# Altium project rmiic.prjpcb
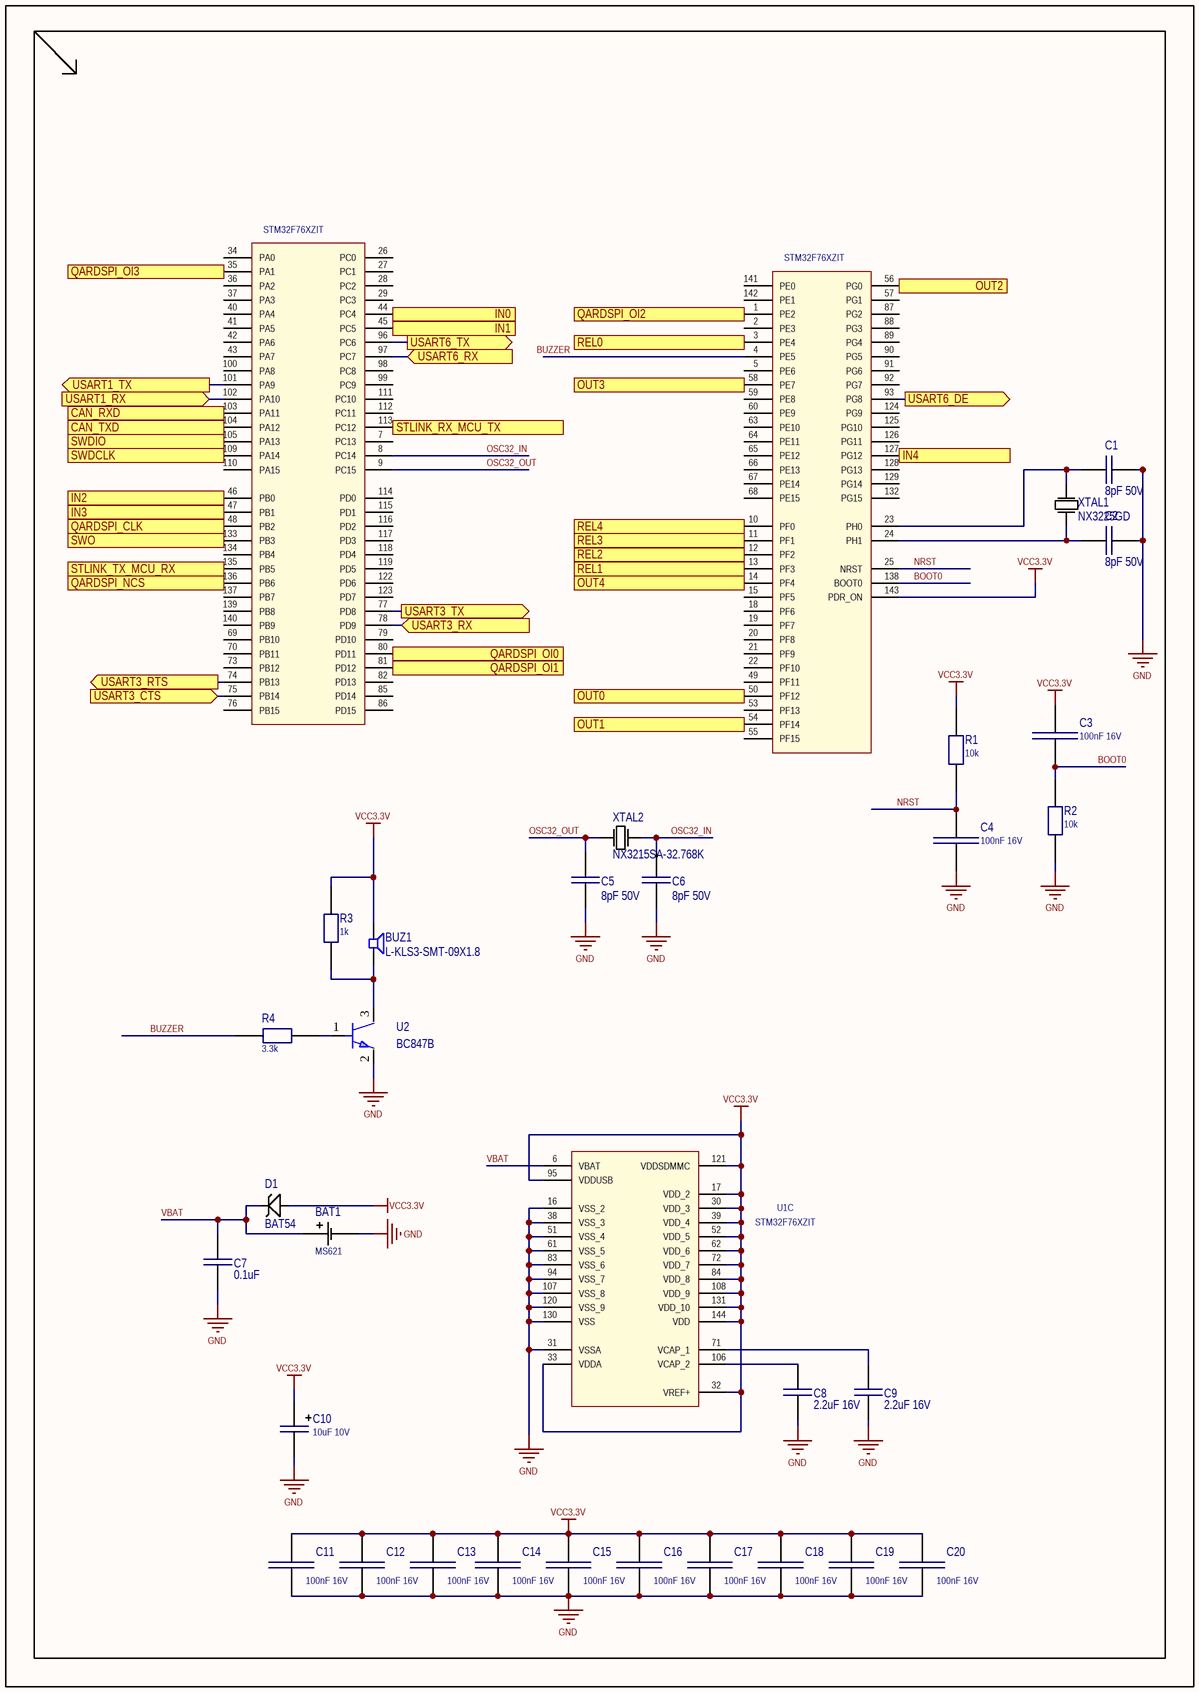
[diagram p0: MCU.SchDoc]
7 sheets, 158 parts. Net scope: flat (ports and power ports of the same name join across sheets).
Board file: PCB.pcbdoc
Sheets:
  MCU.SchDoc
  interfaces.schdoc
  dcdc.schdoc
  qspi_flash.schdoc
  connections.schdoc
  rlink.schdoc
  usb.SchDoc

## Sheet MCU.SchDoc
size 209 x 297 mm; Scale: 1:1; DocumentType: Ñõåìà ýëåêòðè÷åñêàÿ ïðèíöèïèàëüíàÿ; FirstReferrence: ÀÁÂÃ.123456.001; Title1str: {Наименование}; PageSetup: Record=PageOptions¦CenterHorizontal=False¦CenterVertical=False¦PrintScale=0.95¦XCorrection=0.00¦YCorrection=0.00¦PrintKind=1¦BorderSize=5000000¦LeftOffset=0¦BottomOffset=0¦Orientation=1¦PaperLength=1000¦PaperWidth=1000¦Scale=100¦PaperSource=15¦PrintQuality=600¦MediaType=1¦DitherType=10¦PaperKind=A4¦PrintScaleMode=1; DocumentType1str: {Документ}; DocumentType2str: {Документ}

### Parts
BAT1  MS621  [MS621]
BUZ1  L-KLS3-SMT-09X1.8  [SPKR_PKMCS0909E4000-R1]
C1  8pF 50V  [C_0603]
C2  8pF 50V  [C_0603]
C3  100nF 16V  [C_0603]
C4  100nF 16V  [C_0603]
C5  8pF 50V  [C_0603]
C6  8pF 50V  [C_0603]
C7  0.1uF  [C_0603]
C8  2.2uF 16V  [C_0603]
C9  2.2uF 16V  [C_0603]
C10  10uF 10V  [TANTAL_TYPE_A]
C11  100nF 16V  [C_0603]
C12  100nF 16V  [C_0603]
C13  100nF 16V  [C_0603]
C14  100nF 16V  [C_0603]
C15  100nF 16V  [C_0603]
C16  100nF 16V  [C_0603]
C17  100nF 16V  [C_0603]
C18  100nF 16V  [C_0603]
C19  100nF 16V  [C_0603]
C20  100nF 16V  [C_0603]
D1  BAT54  [SOT23]
R1  10k  [R_0603]
R2  10k  [R_0603]
R3  1k  [R_0603]
R4  3.3k  [R_0603]
U1  STM32F76XZIT  [TQFP144_M]  (parts A,B,C of 3)
U2  BC847B  [SOT23]
XTAL1  NX3225GD  [NX3225GD]
XTAL2  NX3215SA-32.768K  [XTAL_NX3215SA-32.768K-STD-MUA-8]

### Ports
CAN_RXD (in), CAN_TXD (out), IN0 (in), IN1 (in), IN2 (in), IN3 (in), IN4 (in), OUT0 (out), OUT1 (out), OUT2 (out), OUT3 (out), OUT4 (out), QARDSPI_CLK, QARDSPI_NCS, QARDSPI_OI0, QARDSPI_OI1, QARDSPI_OI2, QARDSPI_OI3, REL0 (out), REL1 (out), REL2 (out), REL3 (out), REL4 (out), STLINK_RX_MCU_TX, STLINK_TX_MCU_RX, SWDCLK, SWDIO, SWO, USART1_RX (in), USART1_TX (out), USART3_CTS (in), USART3_RTS (out), USART3_RX (in), USART3_TX (out), USART6_DE (out), USART6_RX (in), USART6_TX (out)

### Nets
GND: BAT1.0(-) C1.1 C2.1 C4.1 C5.1 C6.1 C7.1 C8.1 C9.1 C10.2 C11.1 C12.1 C13.1 C14.1 C15.1 C16.1 C17.1 C18.1 C19.1 C20.1 R2.1 U1.16(VSS_2) U1.31(VSSA) U1.38(VSS_3) U1.51(VSS_4) U1.61(VSS_5) U1.83(VSS_6) U1.94(VSS_7) U1.107(VSS_8) U1.120(VSS_9) U1.130(VSS) U2.2
VCC3.3V: BUZ1.1 C3.1 C10.1 C11.2 C12.2 C13.2 C14.2 C15.2 C16.2 C17.2 C18.2 C19.2 C20.2 D1.1 R1.2 R3.2 U1.17(VDD_2) U1.30(VDD_3) U1.32(VREF+) U1.33(VDDA) U1.39(VDD_4) U1.52(VDD_5) U1.62(VDD_6) U1.72(VDD_7) U1.84(VDD_8) U1.95(VDDUSB) U1.108(VDD_9) U1.121(VDDSDMMC) U1.131(VDD_10) U1.143(PDR_ON) U1.144(VDD)
BOOT0: C3.2 R2.2 U1.138(BOOT0)
BUZZER: R4.1 U1.4(PE5)
NRST: C4.2 R1.1 U1.25(NRST)
OSC32_IN: C6.2 U1.8(PC14) XTAL2.2(OSC2)
OSC32_OUT: C5.2 U1.9(PC15) XTAL2.1(OSC1)
STLINK_RX_MCU_TX: U1.113(PC12) ; port STLINK_RX_MCU_TX
STLINK_TX_MCU_RX: U1.135(PB5) ; port STLINK_TX_MCU_RX
SWCLK1: U1.109(PA14) ; port SWDCLK
SWDIO1: U1.105(PA13) ; port SWDIO
SWO1: U1.133(PB3) ; port SWO
VBAT: BAT1.1(+) C7.2 D1.3 U1.6(VBAT)
NetBUZ1_2: BUZ1.2 R3.1 U2.3
NetC1_2: C1.2 U1.23(PH0) XTAL1.2(OSC2)
NetC2_2: C2.2 U1.24(PH1) XTAL1.1(OSC1)
NetC8_2: C8.2 U1.106(VCAP_2)
NetC9_2: C9.2 U1.71(VCAP_1)
NetR4_2: R4.2 U2.1
NetR9_1: U1.44(PC4) ; port IN0
NetR13_1: U1.45(PC5) ; port IN1
NetR16_1: U1.46(PB0) ; port IN2
NetR19_1: U1.47(PB1) ; port IN3
NetR22_1: U1.127(PG12) ; port IN4
NetR24_1: U1.3(PE4) ; port REL0
NetR26_2: U1.50(PF12) ; port OUT0
NetR28_2: U1.54(PF14) ; port OUT1
NetR29_2: U1.56(PG0) ; port OUT2
NetR30_1: U1.13(PF3) ; port REL1
NetR32_2: U1.58(PE7) ; port OUT3
NetR34_2: U1.14(PF4) ; port OUT4
NetR35_1: U1.12(PF2) ; port REL2
NetR38_1: U1.11(PF1) ; port REL3
NetR41_1: U1.10(PF0) ; port REL4
NetR47_2: U1.136(PB6) ; port QARDSPI_NCS
NetU1_1: U1.1(PE2) ; port QARDSPI_OI2
NetU1_35: U1.35(PA1) ; port QARDSPI_OI3
NetU1_48: U1.48(PB2) ; port QARDSPI_CLK
NetU1_74: U1.74(PB13) ; port USART3_RTS
NetU1_75: U1.75(PB14) ; port USART3_CTS
NetU1_77: U1.77(PD8) ; port USART3_TX
NetU1_78: U1.78(PD9) ; port USART3_RX
NetU1_80: U1.80(PD11) ; port QARDSPI_OI0
NetU1_81: U1.81(PD12) ; port QARDSPI_OI1
NetU1_93: U1.93(PG8) ; port USART6_DE
NetU1_96: U1.96(PC6) ; port USART6_TX
NetU1_97: U1.97(PC7) ; port USART6_RX
NetU1_101: U1.101(PA9) ; port USART1_TX
NetU1_102: U1.102(PA10) ; port USART1_RX
NetU1_103: U1.103(PA11) ; port CAN_RXD
NetU1_104: U1.104(PA12) ; port CAN_TXD

Not connected (* = marked no-connect by the designer): U1 2(PE3) 5(PE6) 7(PC13) 15(PF5) 18(PF6) 19(PF7) 20(PF8) 21(PF9) 22(PF10) 26(PC0) 27(PC1) 28(PC2) 29(PC3) 34(PA0) 36(PA2) 37(PA3) 40(PA4) 41(PA5) 42(PA6) 43(PA7) 49(PF11) 53(PF13) 55(PF15) 57(PG1) 59(PE8) 60(PE9) 63(PE10) 64(PE11) 65(PE12) 66(PE13) 67(PE14) 68(PE15) 69(PB10) 70(PB11) 73(PB12) 76(PB15) 79(PD10) 82(PD13) 85(PD14) 86(PD15) 87(PG2) 88(PG3) 89(PG4) 90(PG5) 91(PG6) 92(PG7) 98(PC8) 99(PC9) 100(PA8) 110(PA15) 111(PC10) 112(PC11) 114(PD0) 115(PD1) 116(PD2) 117(PD3) 118(PD4) 119(PD5) 122(PD6) 123(PD7) 124(PG9) 125(PG10) 126(PG11) 128(PG13) 129(PG14) 132(PG15) 134(PB4) 137(PB7) 139(PB8) 140(PB9) 141(PE0) 142(PE1)

### Library data of the parts
BAT1 = MS621: Battery; Part Number: MS621; Alternative Part: *
BUZ1 = BUZZER: Piezoelectric Sounders; Alternative Part: PKLCS1212E40A1-R1; Part Number: L-KLS3-SMT-09X1.8
C1 C2 C5 C6 = CAP_SMD: Capacitor; Part Number: CC0603DRNPO9BN8R0; Alternative Part: *; Value: 8pF 50V
C3 C4 C11-C20 = C0603: Capacitor; Part Number: CC0603KPX7R9BB104; Value: 100nF 16V
C7 = CAP_SMD: Capacitor; Part Number: CC0603KPX7R9BB104; Alternative Part: *; Value: 0.1uF
C8 C9 = CAP_SMD: Capacitor; Part Number: CC0603KRX5R7BB225; Alternative Part: *; Value: 2.2uF 16V
C10 = TANTAL_CAP: Tantal Capacitor; Part Number: 293D106X9010A2TE3; Alternative Part: *; Value: 10uF 10V
D1 = BAT54: Diode; Part Number: BAT54
R1 R2 = RES_SMD: Resistor; Part Number: RC0603FR-0710KL; Alternative Part: *; Value: 10k
R3 = RES_SMD: Resistor; Part Number: RC0603FR-071KL; Alternative Part: *; Value: 1k
R4 = RES_SMD: Resistor; Part Number: RC0603FR-073K3L; Alternative Part: *; Value: 3.3k
U1 = STM32F76XZXT: Part Number: STM32F765ZGT; C: Copyright (C) 2016 Accelerated Designs. All rights reserved; Vendor: STMicroelectronics; Value: STM32F76XZXT; Manufacturer_Part_Number: STM32F76XZXT; Copyright: Copyright (C) 2016 Accelerated Designs. All rights reserved
XTAL1 = NX3225GD: Crystal Oscillator; Part Number: NX3225GD-8MHZ-EXS00A-CG05041; Alternative Part: *
XTAL2 = NX3215SA-32.768K: Crystal Oscillator; Part Number: NX3215SA-32.768K-10PPM-45KOHM-6PF; Alternative Part: *
U2 = BC847B: Part Number: BC847B

## Sheet interfaces.schdoc
size 209 x 297 mm; Scale: 1:1; DocumentType: Ñõåìà ýëåêòðè÷åñêàÿ ïðèíöèïèàëüíàÿ; FirstReferrence: ÀÁÂÃ.123456.001; PageSetup: Record=PageOptions¦CenterHorizontal=False¦CenterVertical=False¦PrintScale=0.95¦XCorrection=0.00¦YCorrection=0.00¦PrintKind=1¦BorderSize=5000000¦LeftOffset=0¦BottomOffset=0¦Orientation=1¦PaperLength=1000¦PaperWidth=1000¦Scale=100¦PaperSource=15¦PrintQuality=600¦MediaType=1¦DitherType=10¦PaperKind=A4¦PrintScaleMode=1
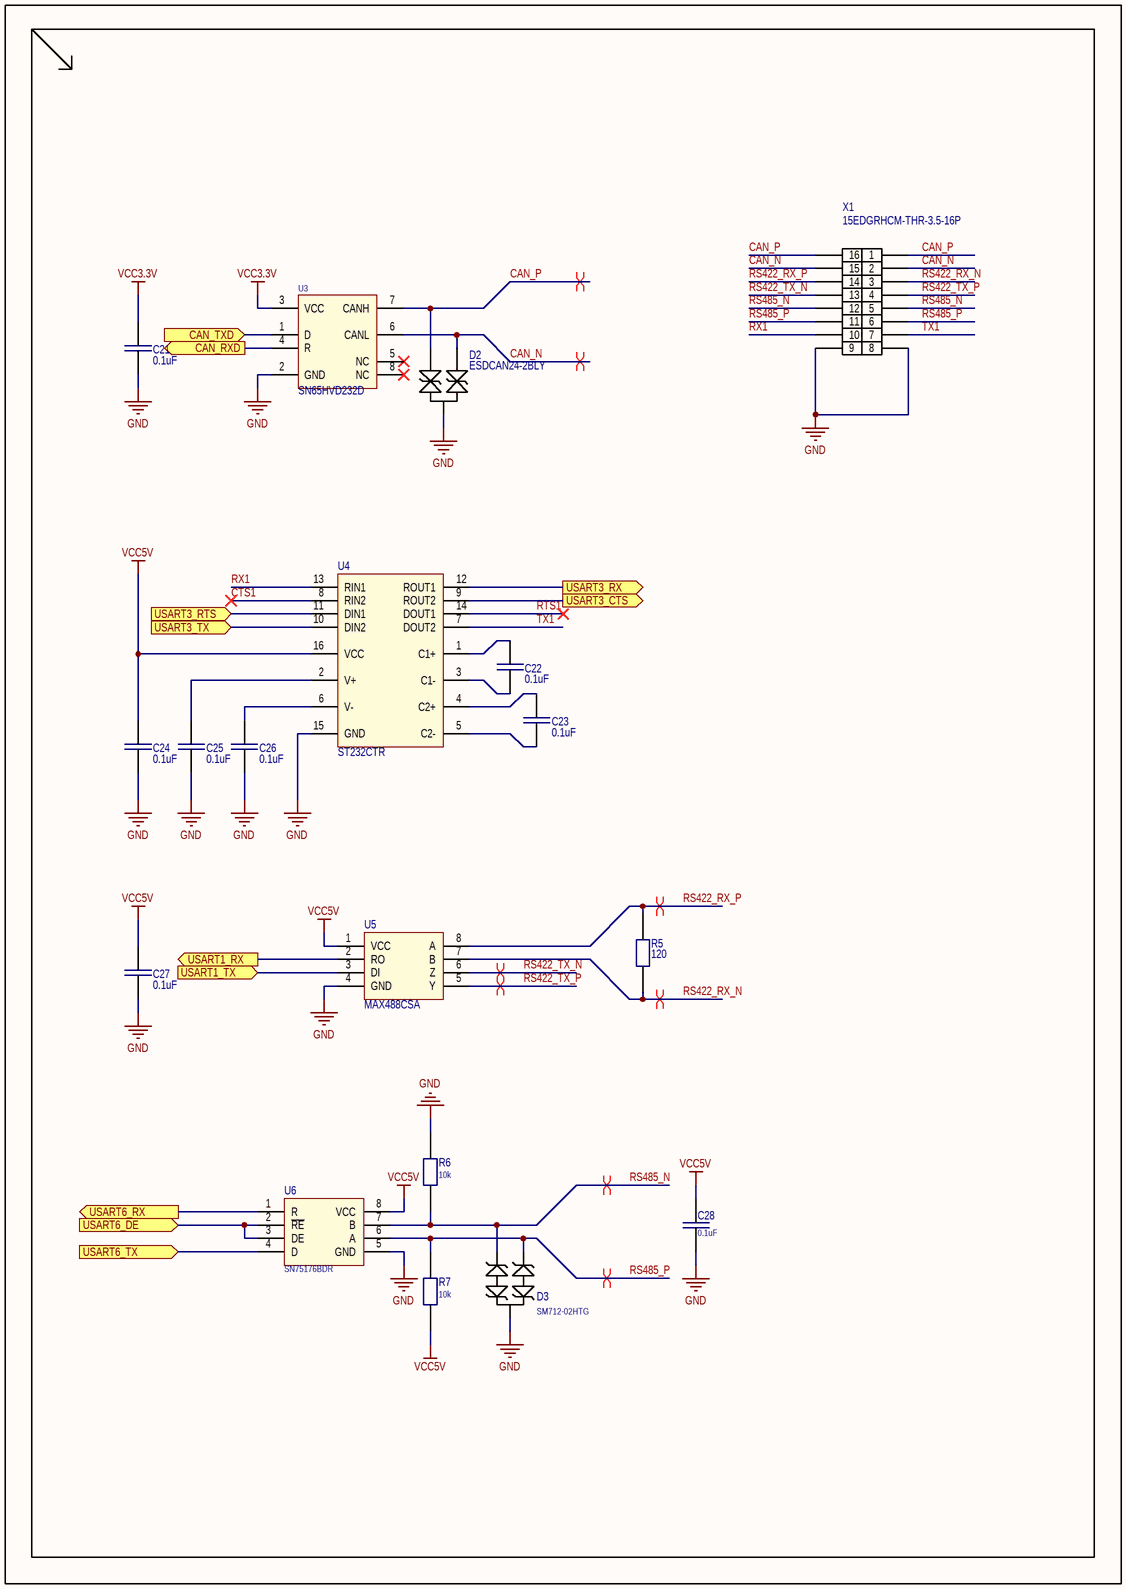
[diagram p1: interfaces.schdoc]

### Parts
C21  0.1uF  [C_0603]
C22  0.1uF  [C_0603]
C23  0.1uF  [C_0603]
C24  0.1uF  [C_0603]
C25  0.1uF  [C_0603]
C26  0.1uF  [C_0603]
C27  0.1uF  [C_0603]
C28  0.1uF  [C_0603]
D2  ESDCAN24-2BLY  [SOT23]
D3  SM712-02HTG  [SOT23]
R5  120  [R_0603]
R6  10k  [R_0603]
R7  10k  [R_0603]
U3  SN65HVD232D  [SO-8_M]
U4  ST232CTR  [TSSOP16_STM]
U5  MAX488CSA  [SO-8_M]
U6  SN75176BDR  [SO-8]
X1  15EDGRHCM-THR-3.5-16P  [DMC 1,5/ 8-G1F-3,5-LR P20THR / 1787072]

### Ports
CAN_RXD (out), CAN_TXD (in), USART1_RX (out), USART1_TX (in), USART3_CTS (out), USART3_RTS (in), USART3_RX (out), USART3_TX (in), USART6_DE (in), USART6_RX (out), USART6_TX (in)

### Nets
GND: C21.1 C24.1 C25.1 C26.1 C27.1 C28.1 D2.3 D3.3 R6.2 U3.2(GND) U4.15(GND) U5.4(GND) U6.5(GND) X1.8 X1.9
VCC3.3V: C21.2 U3.3(VCC)
VCC5V: C24.2 C27.2 C28.2 R7.1 U4.16(VCC) U5.1(VCC) U6.8(VCC)
CAN_N: D2.2 U3.6(CANL) X1.2 X1.15
CAN_P: D2.1 U3.7(CANH) X1.1 X1.16
CTS1: U4.8(RIN2)
RS422_RX_N: R5.2 U5.7(B) X1.3
RS422_RX_P: R5.1 U5.8(A) X1.14
RS422_TX_N: U5.6(Z) X1.13
RS422_TX_P: U5.5(Y) X1.4
RS485_N: D3.1 R6.1 U6.7(B) X1.5 X1.12
RS485_P: D3.2 R7.2 U6.6(A) X1.6 X1.11
RTS1: U4.14(DOUT1)
RX1: U4.13(RIN1) X1.10
TX1: U4.7(DOUT2) X1.7
NetC22_1: C22.1 U4.1(C1+)
NetC22_2: C22.2 U4.3(C1-)
NetC23_1: C23.1 U4.4(C2+)
NetC23_2: C23.2 U4.5(C2-)
NetC25_2: C25.2 U4.2(V+)
NetC26_2: C26.2 U4.6(V-)
NetU1_74: U4.11(DIN1) ; port USART3_RTS
NetU1_75: U4.9(ROUT2) ; port USART3_CTS
NetU1_77: U4.10(DIN2) ; port USART3_TX
NetU1_78: U4.12(ROUT1) ; port USART3_RX
NetU1_93: U6.2(~{RE}) U6.3(DE) ; port USART6_DE
NetU1_96: U6.4(D) ; port USART6_TX
NetU1_97: U6.1(R) ; port USART6_RX
NetU1_101: U5.3(DI) ; port USART1_TX
NetU1_102: U5.2(RO) ; port USART1_RX
NetU1_103: U3.4(R) ; port CAN_RXD
NetU1_104: U3.1(D) ; port CAN_TXD

Not connected (* = marked no-connect by the designer): U3 5(NC)* 8(NC)*

### Layout directives
differential pair: CAN_N, CAN_P, RS422_RX_N, RS422_RX_P, RS422_TX_N, RS422_TX_P, RS485_N, RS485_P

### Library data of the parts
C21 C27 C28 = CAP_SMD: as C7 on sheet MCU; Alternative Part: *; Value: 0.1uF
C22-C26 = C0603: Capacitor; Part: CC0603KPX7R9BB104; Value: 0.1uF
D2 = ESD_CAN: ESD; Value: ESDCAN24-2BLY; Part Number: ESDCAN24-2BLY; Alternative Part: *
D3 = ESD: Value: SM712-02HTG; Part Number: SM712-02HTG; Alternative Part: *
R5 = RES_SMD: Resistor; Part Number: RC0603FR-07120RL; Alternative Part: *; Value: 120
R6 R7 = RES_SMD: Resistor; Part Number: RC0603FR-0710KL; Alternative Part: *; Value: 10k
U3 = SN65HVD232D: CAN_transiever; Part Number: SN65HVD232D; Alternative Part: *
U4 = ST232CTR: No Description Available; Mfr_Name: STMicroelectronics; Copyright: Copyright (C) 2022 Ultra Librarian. All rights reserved.; Part Number: ST232CTR; RefDes: RefDes; Type: DEV
U5 = ADM4855ARZ: RS485 Full Duplex Convertor; Part Number: MAX488CSA; Alternative Part: ADM4855ARZ
U6 = SN75176BDR: RS485 Half Duplex Convertor; Part Number: SN75176BDR
X1 = DMC 1,5/ 8-G1F-3,5-LR P20THR / 1787072: Part Number: 15EDGRHCM-THR-3.5-16P

## Sheet dcdc.schdoc
size 209 x 297 mm; PageSetup: Record=PageOptions|CenterHorizontal=False|CenterVertical=False|PrintScale=0.95|XCorrection=0.00|YCorrection=0.00|PrintKind=1|BorderSize=5000000|LeftOffset=0|BottomOffset=0|Orientation=1|PaperLength=1000|PaperWidth=1000|Scale=100|PaperSource=15|PrintQuality=600|MediaType=1|DitherType=10|PaperKind=A4|PrintScaleMode=1
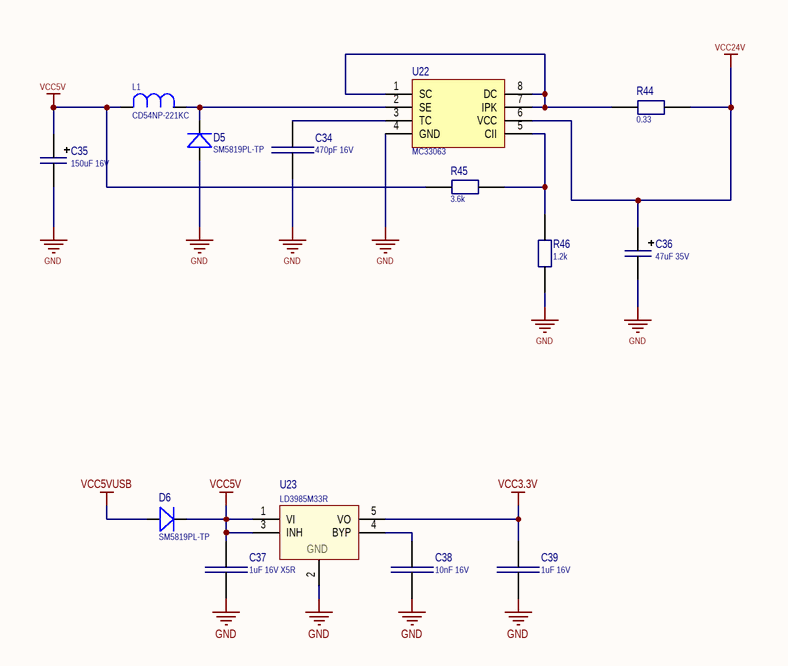
[diagram p2: dcdc.schdoc]

### Parts
C34  470pF 16V  [C_0603]
C35  150uF 16V  [TANTAL_TYPE_D]
C36  47uF 35V  [TANTAL_TYPE_X]
C37  1uF 16V X5R  [C_0603]
C38  10nF 16V  [C_0603]
C39  1uF 16V  [C_0603]
D5  SM5819PL-TP  [SOD-123]
D6  SM5819PL-TP  [SOD-123]
L1  CD54NP-221KC  [CD54NP]
R44  0.33  [R_1206]
R45  3.6k  [R_0603]
R46  1.2k  [R_0603]
U22  MC33063  [SO-8]
U23  LD3985M33R  [SOT23-5]

### Nets
GND: C34.1 C35.2 C36.2 C37.1 C38.1 C39.1 D5.1(A) R46.1 U22.4(GND) U23.2(GND)
VCC3.3V: C39.2 U23.5(VO)
VCC5V: C35.1 C37.2 D6.2(K) L1.2 R45.1 U23.1(VI) U23.3(INH)
VCC5VUSB: D6.1(A)
VCC24V: C36.1 R44.1 U22.6(VCC)
NetC34_2: C34.2 U22.3(TC)
NetC38_2: C38.2 U23.4(BYP)
NetD5_2: D5.2(K) L1.1 U22.2(SE)
NetR44_2: R44.2 U22.1(SC) U22.7(IPK) U22.8(DC)
NetR45_2: R45.2 R46.2 U22.5(CII)

### Library data of the parts
C34 = C0603: Capacitor; Part Number: CC0603KRX7R9BB471; Value: 470pF 16V
C35 = TANTAL_CAP: Tantal Capacitor; Part Number: T491D157K016AT; Alternative Part: *; Value: 150uF 16V
C36 = TANTAL_CAP: Tantal Capacitor; Part Number: T491X476K035AT; Alternative Part: *; Value: 47uF 35V
C37 C39 = C0603: Capacitor; Part Number: CC0603KRX7R7BB105
  C37: Value: 1uF 16V X5R
  C39: Value: 1uF 16V
C38 = C0603: Capacitor; Part Number: CC0603JRX7R7BB103; Value: 10nF 16V
D5 D6 = D_SOD123: Diode; Part Number: SM5819PL-TP
L1 = L_CD54NP: Inductor; Value: CD54NP-221KC; Part Number: CD54NP-221KC
R44 = RES_SMD: Resistor; Part Number: RL1206FR-070R33L; Alternative Part: *; Value: 0.33
R45 = RES_SMD: Resistor; Part Number: RC0603FR-073K6L; Alternative Part: *; Value: 3.6k
R46 = RES_SMD: Resistor; Part Number: RC0603FR-071K2L; Alternative Part: *; Value: 1.2k
U22 = MC33063: Step-up/down IC; Part Number: MC33063; Alternativr Part: *
U23 = LD3985M33R: Part Number: LD3985M33R; Alternative Part: *

## Sheet qspi_flash.schdoc
size 209 x 297 mm; Scale: 1:1; DocumentType: Ñõåìà ýëåêòðè÷åñêàÿ ïðèíöèïèàëüíàÿ; FirstReferrence: ÀÁÂÃ.123456.001; Title1str: {Наименование}; PageSetup: Record=PageOptions¦CenterHorizontal=False¦CenterVertical=False¦PrintScale=0.95¦XCorrection=0.00¦YCorrection=0.00¦PrintKind=1¦BorderSize=5000000¦LeftOffset=0¦BottomOffset=0¦Orientation=1¦PaperLength=1000¦PaperWidth=1000¦Scale=100¦PaperSource=15¦PrintQuality=600¦MediaType=1¦DitherType=10¦PaperKind=A4¦PrintScaleMode=1; DocumentType1str: {Документ}; DocumentType2str: {Документ}
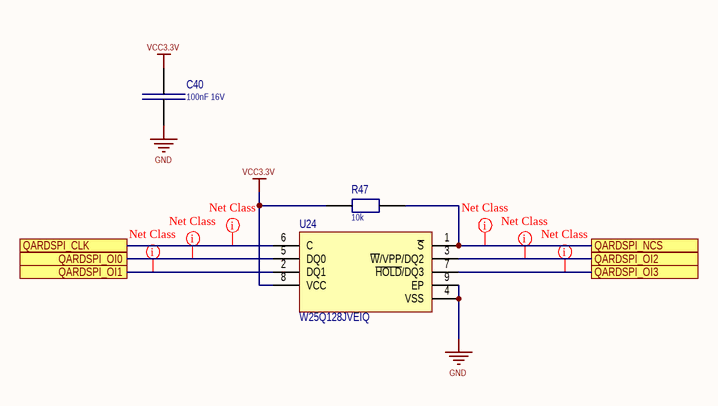
[diagram p3: qspi_flash.schdoc]

### Parts
C40  100nF 16V  [C_0603]
R47  10k  [R_0603]
U24  W25Q128JVEIQ  [W-PDFN-8 (MLP8) – 8mm ? 6mm  Se]

### Ports
QARDSPI_CLK, QARDSPI_NCS, QARDSPI_OI0, QARDSPI_OI1, QARDSPI_OI2, QARDSPI_OI3

### Nets
GND: C40.1 U24.4(VSS) U24.9(EP)
VCC3.3V: C40.2 R47.1 U24.8(VCC)
NetR47_2: R47.2 U24.1(~{S}) ; port QARDSPI_NCS
NetU1_1: U24.3(~{W}/VPP/DQ2) ; port QARDSPI_OI2
NetU1_35: U24.7(~{HOLD}/DQ3) ; port QARDSPI_OI3
NetU1_48: U24.6(C) ; port QARDSPI_CLK
NetU1_80: U24.5(DQ0) ; port QARDSPI_OI0
NetU1_81: U24.2(DQ1) ; port QARDSPI_OI1

### Layout directives
net class Undefined: NetR47_2, NetU1_1, NetU1_35, NetU1_48, NetU1_80, NetU1_81

### Library data of the parts
C40 = C0603: as C3 on sheet MCU; Value: 100nF 16V
R47 = RES_SMD: Resistor; Part Number: RC0603FR-0710KL; Alternative Part: *; Value: 10k
U24 = MT25QL********W9-0SIT: Flash Memory; Part Number: W25Q128JVEIQ; Alternative Part: *

## Sheet connections.schdoc
size 209 x 297 mm; Scale: 1:1; DocumentType: Схема электрическая принципиальная; FirstReferrence: АБВГ.123456.001; PageSetup: Record=PageOptions|CenterHorizontal=False|CenterVertical=False|PrintScale=0.95|XCorrection=0.00|YCorrection=0.00|PrintKind=1|BorderSize=5000000|LeftOffset=0|BottomOffset=0|Orientation=1|PaperLength=1000|PaperWidth=1000|Scale=100|PaperSource=15|PrintQuality=600|MediaType=1|DitherType=10|PaperKind=A4|PrintScaleMode=1
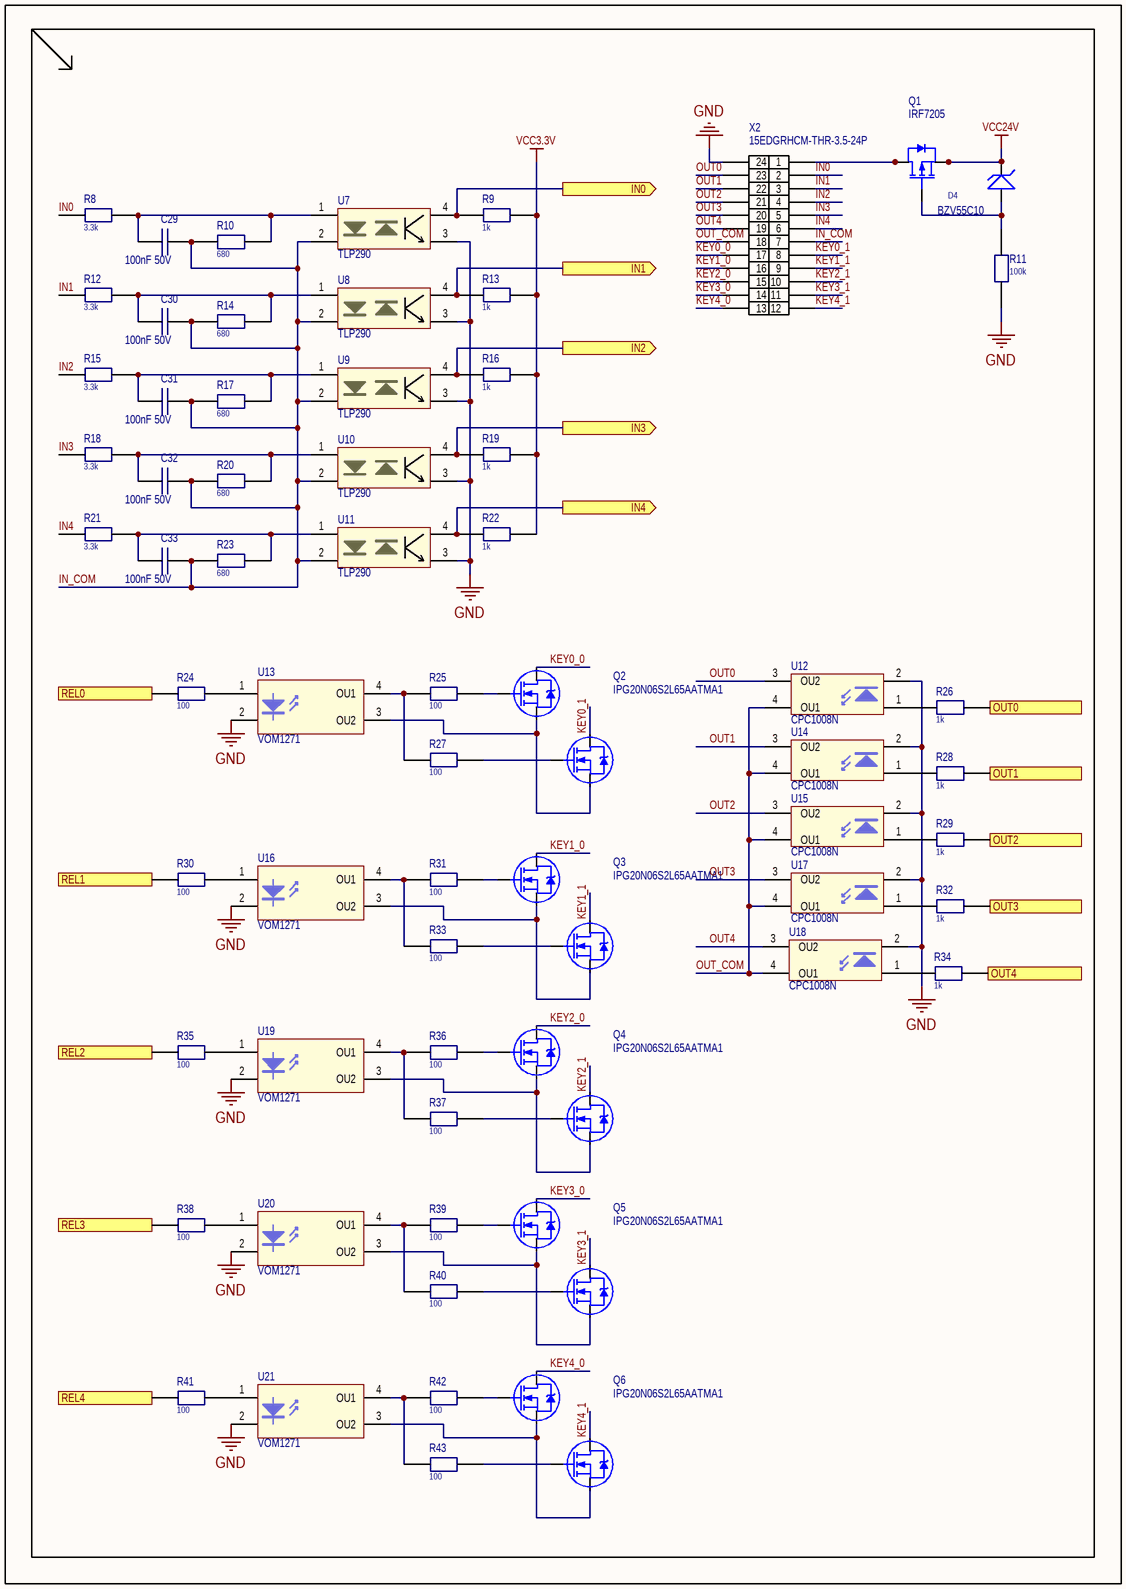
[diagram p4: connections.schdoc]

### Parts
C29  100nF 50V  [C_0603]
C30  100nF 50V  [C_0603]
C31  100nF 50V  [C_0603]
C32  100nF 50V  [C_0603]
C33  100nF 50V  [C_0603]
D4  BZV55C10  [SOD80C]
Q1  IRF7205  [SO-8_M]
Q2  IPG20N06S2L65AATMA1  [PowerFlat 5x6]
Q3  IPG20N06S2L65AATMA1  [PowerFlat 5x6]
Q4  IPG20N06S2L65AATMA1  [PowerFlat 5x6]
Q5  IPG20N06S2L65AATMA1  [PowerFlat 5x6]
Q6  IPG20N06S2L65AATMA1  [PowerFlat 5x6]
R8  3.3k  [R_0603]
R9  1k  [R_0603]
R10  680  [R_0603]
R11  100k  [R_0603]
R12  3.3k  [R_0603]
R13  1k  [R_0603]
R14  680  [R_0603]
R15  3.3k  [R_0603]
R16  1k  [R_0603]
R17  680  [R_0603]
R18  3.3k  [R_0603]
R19  1k  [R_0603]
R20  680  [R_0603]
R21  3.3k  [R_0603]
R22  1k  [R_0603]
R23  680  [R_0603]
R24  100  [R_0603]
R25  100  [R_0603]
R26  1k  [R_0603]
R27  100  [R_0603]
R28  1k  [R_0603]
R29  1k  [R_0603]
R30  100  [R_0603]
R31  100  [R_0603]
R32  1k  [R_0603]
R33  100  [R_0603]
R34  1k  [R_0603]
R35  100  [R_0603]
R36  100  [R_0603]
R37  100  [R_0603]
R38  100  [R_0603]
R39  100  [R_0603]
R40  100  [R_0603]
R41  100  [R_0603]
R42  100  [R_0603]
R43  100  [R_0603]
U7  TLP290  [SO4_1.27]
U8  TLP290  [SO4_1.27]
U9  TLP290  [SO4_1.27]
U10  TLP290  [SO4_1.27]
U11  TLP290  [SO4_1.27]
U12  CPC1008N  [SO4_2_54]
U13  VOM1271  [SOP-4]
U14  CPC1008N  [SO4_2_54]
U15  CPC1008N  [SO4_2_54]
U16  VOM1271  [SOP-4]
U17  CPC1008N  [SO4_2_54]
U18  CPC1008N  [SO4_2_54]
U19  VOM1271  [SOP-4]
U20  VOM1271  [SOP-4]
U21  VOM1271  [SOP-4]
X2  15EDGRHCM-THR-3.5-24P  [DMC 1,5/12-G1F-3,5-LRP20THRR72]

### Ports
IN0 (out), IN1 (out), IN2 (out), IN3 (out), IN4 (out), OUT0 (in), OUT1 (in), OUT2 (in), OUT3 (in), OUT4 (in), REL0 (in), REL1 (in), REL2 (in), REL3 (in), REL4 (in)

### Nets
GND: R11.2 U7.3 U8.3 U9.3 U10.3 U11.3 U12.2(K) U13.2(K) U14.2(K) U15.2(K) U16.2(K) U17.2(K) U18.2(K) U19.2(K) U20.2(K) U21.2(K) X2.24
VCC3.3V: R9.2 R13.2 R16.2 R19.2 R22.2
VCC24V: D4.2(K) Q1.1(S) Q1.2(S) Q1.3(S)
IN0: R8.1 X2.2
IN1: R12.1 X2.3
IN2: R15.1 X2.4
IN3: R18.1 X2.5
IN4: R21.1 X2.6
IN_COM: C29.1 C30.1 C31.1 C32.1 C33.1 R10.1 R14.1 R17.1 R20.1 R23.1 U7.2 U8.2 U9.2 U10.2 U11.2 X2.7
KEY0_0: Q2.3(D) X2.17
KEY0_1: Q2.6(D) X2.8
KEY1_0: Q3.3(D) X2.16
KEY1_1: Q3.6(D) X2.9
KEY2_0: Q4.3(D) X2.15
KEY2_1: Q4.6(D) X2.10
KEY3_0: Q5.3(D) X2.14
KEY3_1: Q5.6(D) X2.11
KEY4_0: Q6.3(D) X2.13
KEY4_1: Q6.6(D) X2.12
OUT0: U12.3(OU2) X2.23
OUT1: U14.3(OU2) X2.22
OUT2: U15.3(OU2) X2.21
OUT3: U17.3(OU2) X2.20
OUT4: U18.3(OU2) X2.19
OUT_COM: U12.4(OU1) U14.4(OU1) U15.4(OU1) U17.4(OU1) U18.4(OU1) X2.18
NetC29_2: C29.2 R8.2 R10.2 U7.1
NetC30_2: C30.2 R12.2 R14.2 U8.1
NetC31_2: C31.2 R15.2 R17.2 U9.1
NetC32_2: C32.2 R18.2 R20.2 U10.1
NetC33_2: C33.2 R21.2 R23.2 U11.1
NetD4_1: D4.1(A) Q1.4(G) R11.1
NetQ1_5: Q1.5(D) Q1.6(D) Q1.7(D) Q1.8(D) X2.1
NetQ2_1: Q2.1(G) R25.2
NetQ2_2: Q2.2(S) Q2.5(S) U13.3(OU2)
NetQ2_4: Q2.4(G) R27.2
NetQ3_1: Q3.1(G) R31.2
NetQ3_2: Q3.2(S) Q3.5(S) U16.3(OU2)
NetQ3_4: Q3.4(G) R33.2
NetQ4_1: Q4.1(G) R36.2
NetQ4_2: Q4.2(S) Q4.5(S) U19.3(OU2)
NetQ4_4: Q4.4(G) R37.2
NetQ5_1: Q5.1(G) R39.2
NetQ5_2: Q5.2(S) Q5.5(S) U20.3(OU2)
NetQ5_4: Q5.4(G) R40.2
NetQ6_1: Q6.1(G) R42.2
NetQ6_2: Q6.2(S) Q6.5(S) U21.3(OU2)
NetQ6_4: Q6.4(G) R43.2
NetR9_1: R9.1 U7.4 ; port IN0
NetR13_1: R13.1 U8.4 ; port IN1
NetR16_1: R16.1 U9.4 ; port IN2
NetR19_1: R19.1 U10.4 ; port IN3
NetR22_1: R22.1 U11.4 ; port IN4
NetR24_1: R24.1 ; port REL0
NetR24_2: R24.2 U13.1(A)
NetR25_1: R25.1 R27.1 U13.4(OU1)
NetR26_1: R26.1 U12.1(A)
NetR26_2: R26.2 ; port OUT0
NetR28_1: R28.1 U14.1(A)
NetR28_2: R28.2 ; port OUT1
NetR29_1: R29.1 U15.1(A)
NetR29_2: R29.2 ; port OUT2
NetR30_1: R30.1 ; port REL1
NetR30_2: R30.2 U16.1(A)
NetR31_1: R31.1 R33.1 U16.4(OU1)
NetR32_1: R32.1 U17.1(A)
NetR32_2: R32.2 ; port OUT3
NetR34_1: R34.1 U18.1(A)
NetR34_2: R34.2 ; port OUT4
NetR35_1: R35.1 ; port REL2
NetR35_2: R35.2 U19.1(A)
NetR36_1: R36.1 R37.1 U19.4(OU1)
NetR38_1: R38.1 ; port REL3
NetR38_2: R38.2 U20.1(A)
NetR39_1: R39.1 R40.1 U20.4(OU1)
NetR41_1: R41.1 ; port REL4
NetR41_2: R41.2 U21.1(A)
NetR42_1: R42.1 R43.1 U21.4(OU1)

### Library data of the parts
C29-C33 = CAP_SMD: Capacitor; Part Number: CC0603JPX7R9BB104; Alternative Part: *; Value: 100nF 50V
D4 = DZ_SOD80: Diode; Part Number: BZV55C10
Q1 = P-ch_SO8: 30V P-Channel  MOSFET; Part Number: IRF7205
Q2-Q6 = N-ch Dual PowerFLAT 5x6_1: Dual N-ch Mosfet; Part Number: IPG20N06S2L65AATMA1
R8 R12 R15 R18 R21 = RES_SMD: Resistor; Part Number: RC0603FR-073K3L; Alternative Part: *; Value: 3.3k
R9 R13 R16 R19 R22 R26 R28 R29 R32 R34 = RES_SMD: Resistor; Part Number: RC0603FR-071KL; Alternative Part: *; Value: 1k
R10 R14 R17 R20 R23 = RES_SMD: Resistor; Part Number: RC0603FR-07680RL; Alternative Part: *; Value: 680
R11 R24 R25 R27 R30 R31 R33 R35-R43 = RES_SMD: Resistor; Part Number: RC0603JR-07100RL; Alternative Part: *
  R11: Value: 100k
  R24 R25 R27 R30 R31 R33 R35-R43: Value: 100
U7-U11 = TLP290: 4-Pin Phototransistor Optocoupler; Published: 24-Mar-1999; LatestRevisionDate: 04-Mar-2005; LatestRevisionNote: Sch pins 3 & 4 Swapped.; DatasheetVersion: Nov-2003; PackageReference: SO-4; Publisher: Altium Limited; Part Number: TLP290; Alternative Part: *
U12 U14 U15 U17 U18 = OptoMOS_SO4: 4-Pin Phototransistor Optocoupler; Published: 24-Mar-1999; LatestRevisionDate: 04-Mar-2005; LatestRevisionNote: Sch pins 3 & 4 Swapped.; DatasheetVersion: Nov-2003; PackageReference: SO-4; Publisher: Altium Limited; Part Number: CPC1008N; Alternative Part: *
U13 U16 U19-U21 = VOM1271: Photovoltaic MOSFET Driver; Part Number: VOM1271; Alternative Part: *
X2 = DMC 1,5/12-G1F-3,5-LRP20THRR72 / 1706067: Part Number: 15EDGRHCM-THR-3.5-24P

## Sheet rlink.schdoc
size 209 x 297 mm; Scale: 1:1; DocumentType: Схема электрическая принципиальная; FirstReferrence: АБВГ.123456.001; PageSetup: Record=PageOptions|CenterHorizontal=False|CenterVertical=False|PrintScale=0.95|XCorrection=0.00|YCorrection=0.00|PrintKind=1|BorderSize=5000000|LeftOffset=0|BottomOffset=0|Orientation=1|PaperLength=1000|PaperWidth=1000|Scale=100|PaperSource=15|PrintQuality=600|MediaType=1|DitherType=10|PaperKind=A4|PrintScaleMode=1
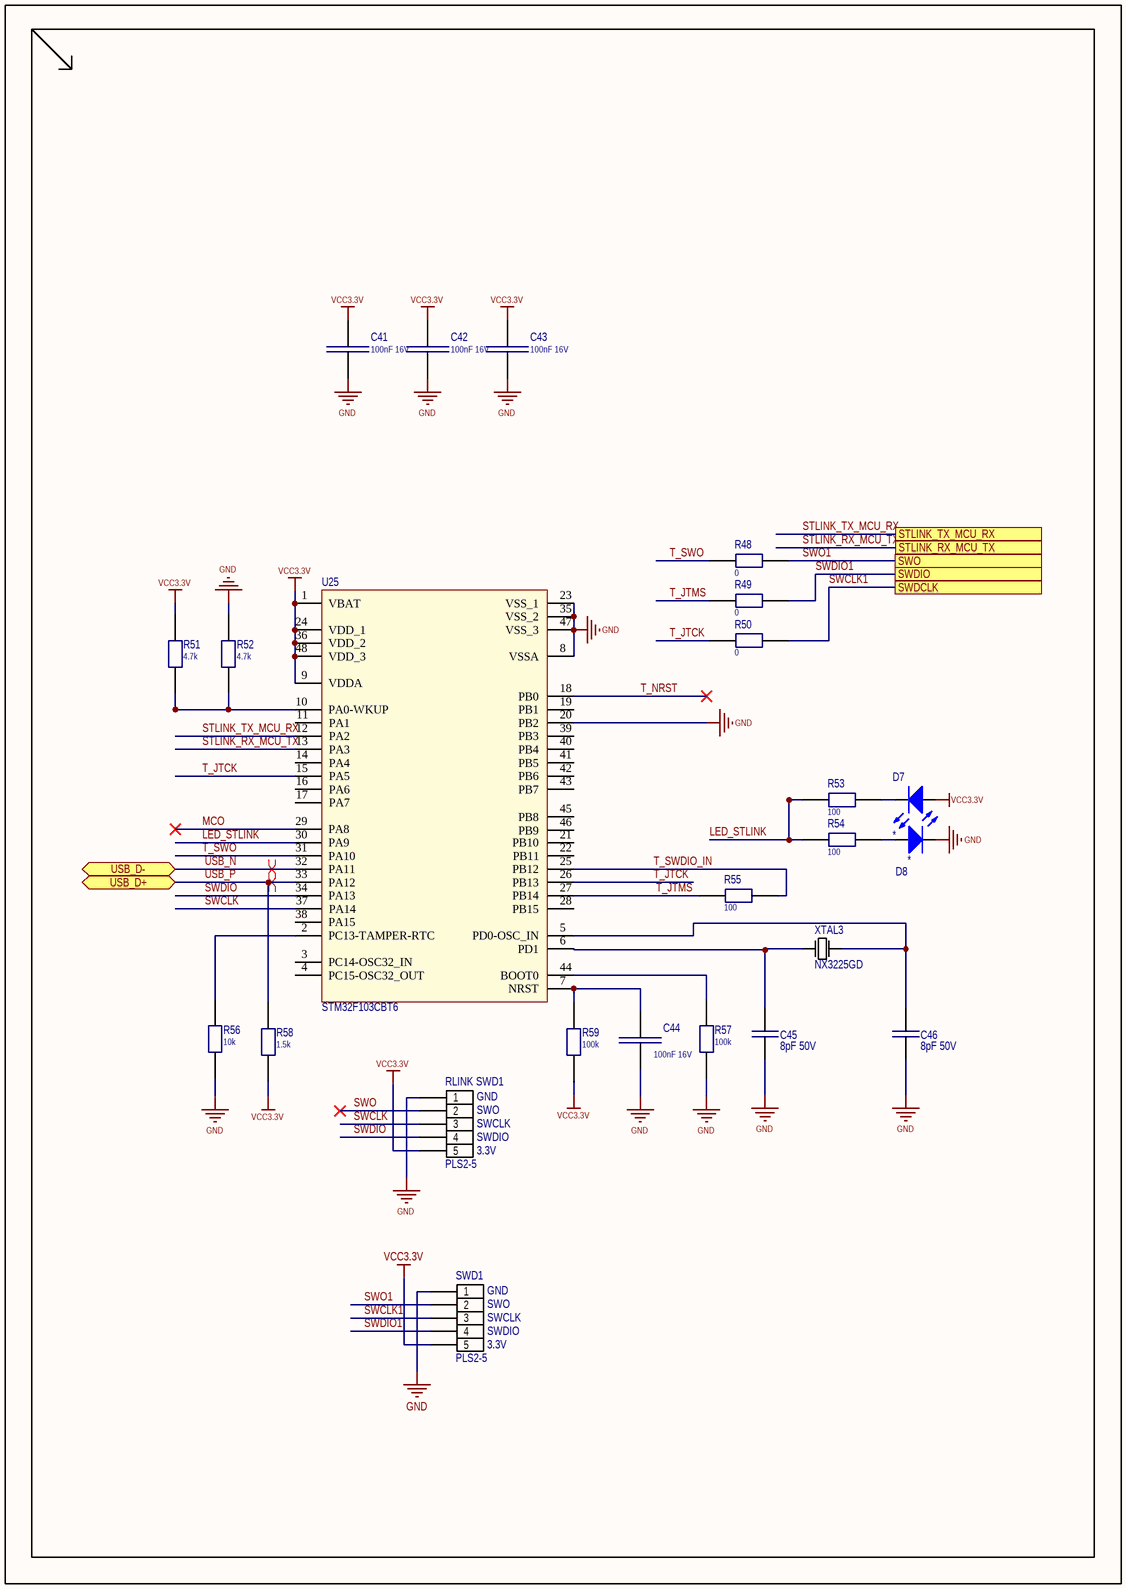
[diagram p5: rlink.schdoc]

### Parts
C41  100nF 16V  [C_0603]
C42  100nF 16V  [C_0603]
C43  100nF 16V  [C_0603]
C44  100nF 16V  [C_0603]
C45  8pF 50V  [C_0603]
C46  8pF 50V  [C_0603]
D7  *  [LED_1206]
D8  *  [LED_1206]
R48  0  [R_0603]
R49  0  [R_0603]
R50  0  [R_0603]
R51  4.7k  [R_0603]
R52  4.7k  [R_0603]
R53  100  [R_0603]
R54  100  [R_0603]
R55  100  [R_0603]
R56  10k  [R_0603]
R57  100k  [R_0603]
R58  1.5k  [R_0603]
R59  100k  [R_0603]
RLINK_SWD1  PLS2-5  [PLS-5-3D]
SWD1  PLS2-5  [PLS-5-3D]
U25  STM32F103CBT6  [LQFP48_L]
XTAL3  NX3225GD  [NX3225GD]

### Ports
STLINK_RX_MCU_TX, STLINK_TX_MCU_RX, SWDCLK, SWDIO, SWO, USB_D+ (bidir), USB_D- (bidir)

### Nets
GND: C41.1 C42.1 C43.1 C44.1 C45.1 C46.1 D8.2(K) R52.2 R56.2 R57.2 RLINK_SWD1.1 SWD1.1 U25.8(VSSA) U25.20(PB2) U25.23(VSS_1) U25.35(VSS_2) U25.47(VSS_3)
VCC3.3V: C41.2 C42.2 C43.2 D7.1(A) R51.2 R58.2 R59.2 RLINK_SWD1.5 SWD1.5 U25.1(VBAT) U25.9(VDDA) U25.24(VDD_1) U25.36(VDD_2) U25.48(VDD_3)
LED_STLINK: R53.2 R54.2 U25.30(PA9)
MCO: U25.29(PA8)
STLINK_RX_MCU_TX: U25.13(PA3) ; port STLINK_RX_MCU_TX
STLINK_TX_MCU_RX: U25.12(PA2) ; port STLINK_TX_MCU_RX
SWCLK: RLINK_SWD1.3 U25.37(PA14)
SWCLK1: R50.1 SWD1.3 ; port SWDCLK
SWDIO: RLINK_SWD1.4 U25.34(PA13)
SWDIO1: R49.1 SWD1.4 ; port SWDIO
SWO: RLINK_SWD1.2
SWO1: R48.1 SWD1.2 ; port SWO
T_JTCK: R50.2 U25.15(PA5) U25.26(PB13)
T_JTMS: R49.2 R55.2 U25.27(PB14)
T_NRST: U25.18(PB0)
T_SWDIO_IN: R55.1 U25.25(PB12)
T_SWO: R48.2 U25.31(PA10)
USB_N: U25.32(PA11) ; port USB_D-
USB_P: R58.1 U25.33(PA12) ; port USB_D+
NetC44_2: C44.2 R59.1 U25.7(NRST)
NetC45_2: C45.2 U25.6(PD1) XTAL3.2(OSC2)
NetC46_2: C46.2 U25.5(PD0-OSC_IN) XTAL3.1(OSC1)
NetD7_2: D7.2(K) R53.1
NetD8_1: D8.1(A) R54.1
NetR51_1: R51.1 R52.1 U25.10(PA0-WKUP)
NetR56_1: R56.1 U25.2(PC13-TAMPER-RTC)
NetR57_1: R57.1 U25.44(BOOT0)

Not connected (* = marked no-connect by the designer): U25 3(PC14-OSC32_IN) 4(PC15-OSC32_OUT) 11(PA1) 14(PA4) 16(PA6) 17(PA7) 19(PB1) 21(PB10) 22(PB11) 28(PB15) 38(PA15) 39(PB3) 40(PB4) 41(PB5) 42(PB6) 43(PB7) 45(PB8) 46(PB9)

### Layout directives
differential pair: USB_N, USB_P

### Notes on the sheet
- (in symbol PLS2-5) GND; SWO; SWCLK; SWDIO; 3.3V

### Library data of the parts
C41-C44 = C0603: as C3 on sheet MCU; Value: 100nF 16V
C45 C46 = CAP_SMD: as C1 on sheet MCU; Alternative Part: *; Value: 8pF 50V
D7 D8 = LED_SMT_1206: Typical INFRARED GaAs LED; Part Number: KP-3216SGD; Value: *; Color: *
R48-R50 = RES_SMD: Resistor; Part Number: RC0603FR-070RL; Alternative Part: *; Value: 0
R51 R52 = RES_SMD: Resistor; Part Number: RC0603FR-074K7L; Alternative Part: *; Value: 4.7k
R53-R55 = RES_SMD: Resistor; Part Number: RC0603JR-07100RL; Alternative Part: *; Value: 100
R56 = RES_SMD: Resistor; Part Number: RC0603FR-0710KL; Alternative Part: *; Value: 10k
R57 R59 = RES_SMD: Resistor; Part Number: RC0603FR-07100KL; Alternative Part: *; Value: 100k
R58 = RES_SMD: Resistor; Part Number: RC0603FR-071K5L; Alternative Part: *; Value: 1.5k
RLINK_SWD1 SWD1 = PLS2-5: Header, 5-Pin; Part Number: PLS-5; LatestRevisionDate: 17-Jul-2002; LatestRevisionNote: Re-released for DXP Platform.; Publisher: Altium Limited
U25 = STM32F103C8T6(1): Part Number: STM32F103CBT6; Alternative Part: *
XTAL3 = NX3225GD: as XTAL1 on sheet MCU; Alternative Part: *

## Sheet usb.SchDoc: {Наименование}
size 209 x 297 mm; DocumentNumber: {Обозначение}; SheetNumber: {}; SheetTotal: {}; PageSetup: Record=PageOptions|CenterHorizontal=False|CenterVertical=False|PrintScale=0.95|XCorrection=0.00|YCorrection=0.00|PrintKind=1|BorderSize=5000000|LeftOffset=0|BottomOffset=0|Orientation=1|PaperLength=1000|PaperWidth=1000|Scale=100|PaperSource=15|PrintQuality=600|MediaType=1|DitherType=10|PaperKind=A4|PrintScaleMode=1; Rule: PcbType=ProtelPcb
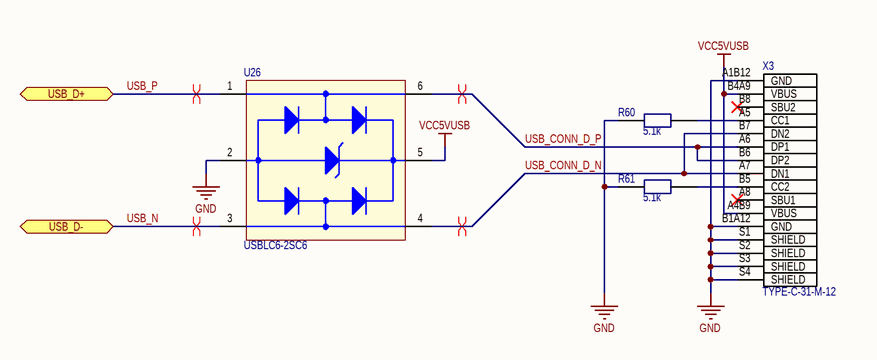
[diagram p6: usb.SchDoc]

### Parts
R60  5.1k  [R_0603]
R61  5.1k  [R_0603]
U26  USBLC6-2SC6  [SOT95P280X145-6N]
X3  TYPE-C-31-M-12  [HRO_TYPE-C-31-M-12]

### Ports
USB_D+ (bidir), USB_D- (bidir)

### Nets
GND: R60.1 R61.1 U26.2(GND) X3.A1B12(GND) X3.B1A12(GND) X3.S1(SHIELD) X3.S2(SHIELD) X3.S3(SHIELD) X3.S4(SHIELD)
VCC5VUSB: U26.5(VBUS) X3.A4B9(VBUS) X3.B4A9(VBUS)
USB_CONN_D_N: U26.4(I/O2_OUT) X3.A7(DN1) X3.B7(DN2)
USB_CONN_D_P: U26.6(I/O1_OUT) X3.A6(DP1) X3.B6(DP2)
USB_N: U26.3(I/O2_IN) ; port USB_D-
USB_P: U26.1(I/O1_IN) ; port USB_D+
NetR60_2: R60.2 X3.A5(CC1)
NetR61_2: R61.2 X3.B5(CC2)

Not connected (* = marked no-connect by the designer): X3 A8(SBU1)* B8(SBU2)*

### Layout directives
differential pair: USB_CONN_D_N, USB_CONN_D_P, USB_N, USB_P

### Library data of the parts
R60 R61 = RES_SMD: Resistor; Part Number: RC0603JR-075K1L; Alternative Part: *; Value: 5.1k
U26 = USBLC6-2SC6: 17V Clamp 5A (8/20Âµs) Ipp Tvs Diode Surface Mount SOT-23-6; MF: STMicroelectronics; Value: *; Check_prices: https://www.snapeda.com/parts/USBLC6-2SC6/STMicroelectronics/view-part/?ref=eda; MP: USBLC6-2SC6; Purchase-URL: https://pricing.snapeda.com/search/part/USBLC6-2SC6/?ref=eda; Price: None; Availability: In Stock; Package: SOT-23-6 STMicroelectronics; SnapEDA_Link: https://www.snapeda.com/parts/USBLC6-2SC6/STMicroelectronics/view-part/?ref=snap; Part Number: USBLC6-2SC6; Alternative Part: *
X3 = TYPE-C-31-M-12: USB Connectors 24 Receptacle 1 8.94*7.3mm RoHS; Package: None; Availability: Unavailable; Value: *; MP: TYPE-C-31-M-12; Price: None; Part Number: TYPE-C-31-M-12; Alternative Part: *

## Nets that join several sheets
GND: MCU (32 pins), interfaces (15 pins), dcdc (10 pins), qspi_flash (C40.1 U24.4 U24.9), connections (17 pins), rlink (17 pins), usb (9 pins)
VCC3.3V: MCU (31 pins), interfaces (C21.2 U3.3), dcdc (C39.2 U23.5), qspi_flash (C40.2 R47.1 U24.8), connections (5 pins), rlink (14 pins)
VCC5V: interfaces (7 pins), dcdc (7 pins)
VCC5VUSB: dcdc (D6.1), usb (U26.5 X3.A4B9 X3.B4A9)
VCC24V: dcdc (C36.1 R44.1 U22.6), connections (D4.2 Q1.1 Q1.2 Q1.3)
NetR9_1: MCU (U1.44), connections (R9.1 U7.4)
NetR13_1: MCU (U1.45), connections (R13.1 U8.4)
NetR16_1: MCU (U1.46), connections (R16.1 U9.4)
NetR19_1: MCU (U1.47), connections (R19.1 U10.4)
NetR22_1: MCU (U1.127), connections (R22.1 U11.4)
NetR24_1: MCU (U1.3), connections (R24.1)
NetR26_2: MCU (U1.50), connections (R26.2)
NetR28_2: MCU (U1.54), connections (R28.2)
NetR29_2: MCU (U1.56), connections (R29.2)
NetR30_1: MCU (U1.13), connections (R30.1)
NetR32_2: MCU (U1.58), connections (R32.2)
NetR34_2: MCU (U1.14), connections (R34.2)
NetR35_1: MCU (U1.12), connections (R35.1)
NetR38_1: MCU (U1.11), connections (R38.1)
NetR41_1: MCU (U1.10), connections (R41.1)
NetR47_2: MCU (U1.136), qspi_flash (R47.2 U24.1)
NetU1_1: MCU (U1.1), qspi_flash (U24.3)
NetU1_35: MCU (U1.35), qspi_flash (U24.7)
NetU1_48: MCU (U1.48), qspi_flash (U24.6)
NetU1_74: MCU (U1.74), interfaces (U4.11)
NetU1_75: MCU (U1.75), interfaces (U4.9)
NetU1_77: MCU (U1.77), interfaces (U4.10)
NetU1_78: MCU (U1.78), interfaces (U4.12)
NetU1_80: MCU (U1.80), qspi_flash (U24.5)
NetU1_81: MCU (U1.81), qspi_flash (U24.2)
NetU1_93: MCU (U1.93), interfaces (U6.2 U6.3)
NetU1_96: MCU (U1.96), interfaces (U6.4)
NetU1_97: MCU (U1.97), interfaces (U6.1)
NetU1_101: MCU (U1.101), interfaces (U5.3)
NetU1_102: MCU (U1.102), interfaces (U5.2)
NetU1_103: MCU (U1.103), interfaces (U3.4)
NetU1_104: MCU (U1.104), interfaces (U3.1)
STLINK_RX_MCU_TX: MCU (U1.113), rlink (U25.13)
STLINK_TX_MCU_RX: MCU (U1.135), rlink (U25.12)
SWCLK1: MCU (U1.109), rlink (R50.1 SWD1.3)
SWDIO1: MCU (U1.105), rlink (R49.1 SWD1.4)
SWO1: MCU (U1.133), rlink (R48.1 SWD1.2)
USB_N: rlink (U25.32), usb (U26.3)
USB_P: rlink (R58.1 U25.33), usb (U26.1)